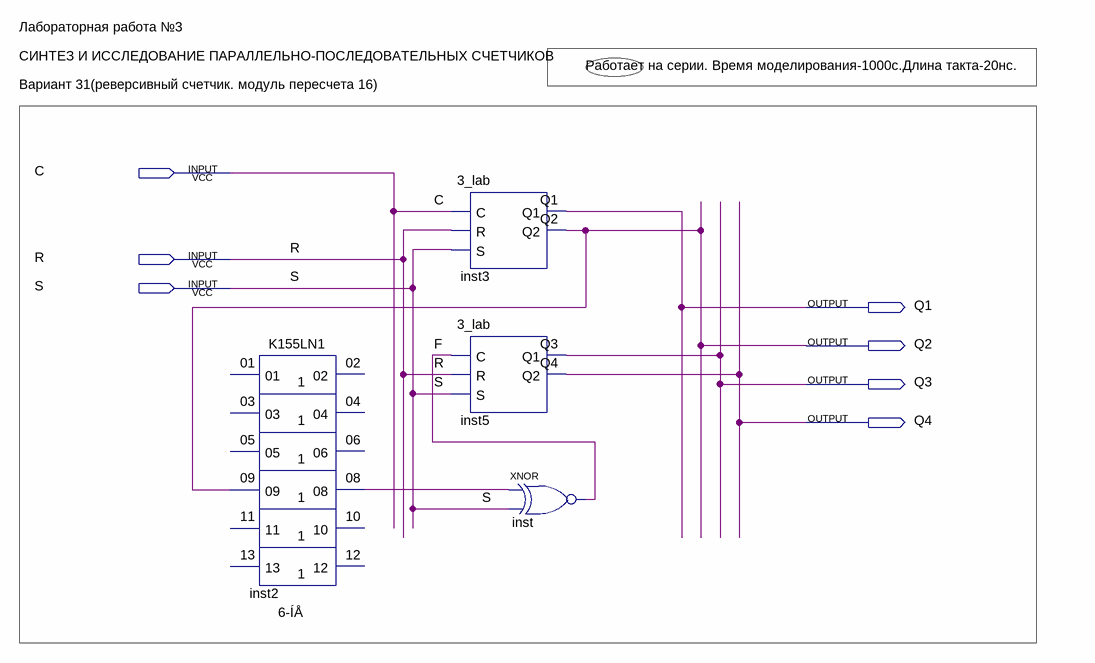
[diagram p0: schematic sheet]
// Quartus schematic 2_labb.bdf as structural Verilog: 4 symbols, 7 pins
module \2_labb  (
  input  C,
  input  R,
  input  S,
  output Q1,
  output Q2,
  output Q3,
  output Q4
);

  wire F, inst2_08;

  K155LN1 inst2 (.\09 (Q2), .\08 (inst2_08));  // open: 01, 03, 05, 11, 13, 02, 04, 06, 10, 12
  \3_lab  inst3 (.C(C), .R(R), .S(S), .Q1(Q1), .Q2(Q2));
  \3_lab  inst5 (.C(F), .R(R), .S(S), .Q1(Q3), .Q2(Q4));
  xnor inst (F, inst2_08, S);

  // Notes on the sheet:
  //   Лабораторная работа №3
  //   СИНТЕЗ И ИССЛЕДОВАНИЕ ПАРАЛЛЕЛЬНО-ПОСЛЕДОВАТЕЛЬНЫХ СЧЕТЧИКОВ
  //   Работает на серии. Время моделирования-1000с.Длина такта-20нс.
  //   Вариант 31(реверсивный счетчик. модуль пересчета 16)
endmodule
